# Altium schematic sheet Sheet2.SchDoc
size A2
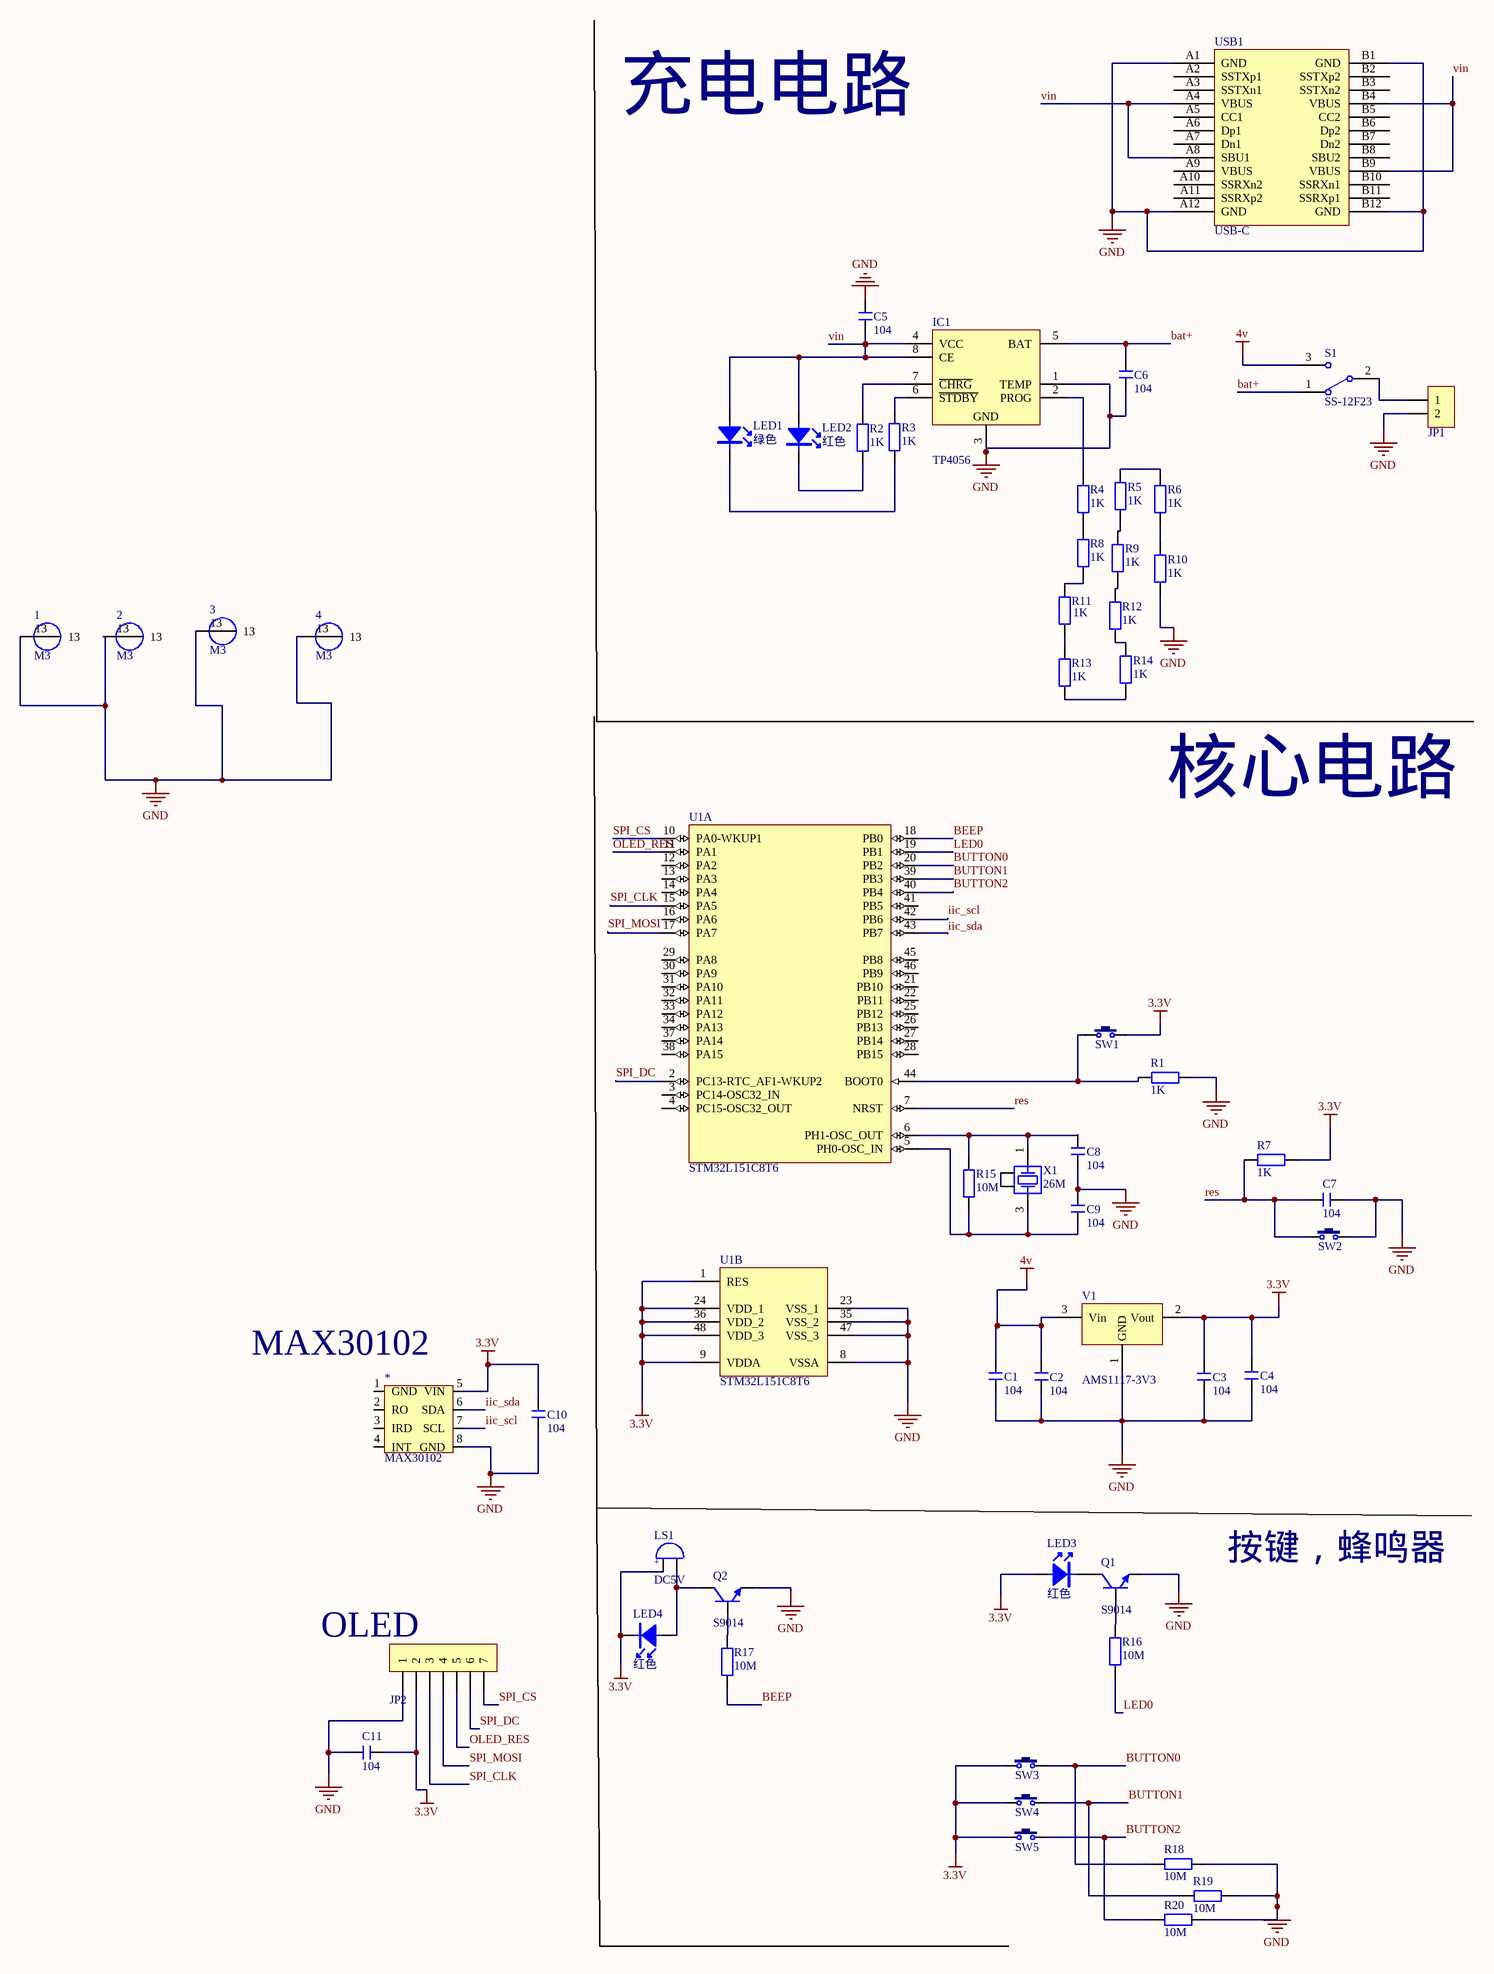
[diagram p0: Sheet2.SchDoc]

## Parts
1  M3  [M3 125X200]
2  M3  [M3 125X200]
3  M3  [M3 125X200]
4  M3  [M3 125X200]
*  MAX30102  [MAX30102]
C1  104  [C 0805_L]
C2  104  [C 0805_L]
C3  104  [C 0805_L]
C4  104  [C 0805_L]
C5  104  [C 0805_L]
C6  104  [C 0805_L]
C7  104  [C 0805_L]
C8  104  [C 0805_L]
C9  104  [C 0805_L]
C10  104  [C 0805_L]
C11  104  [C 0805_L]
IC1  TP4056  [SOP8_N]
JP1  HDR-1X2  [HDR2.54-LI-2P]  (value not drawn)
JP2  HDR-1X7  [HDR2.54-LI-7P]  (value not drawn)
LED1  绿色  [LED 0805G]
LED2  红色  [LED 0805G]
LED3  红色  [LED 0805G]
LED4  红色  [LED 0805G]
LS1  DC5V  [BEEP 5x9x5.5]
Q1  S9014  [SOT23-3N]
Q2  S9014  [SOT23-3N]
R1  1K  [R 0805_L]
R2  1K  [R 0805_L]
R3  1K  [R 0805_L]
R4  1K  [R 0805_L]
R5  1K  [R 0805_L]
R6  1K  [R 0805_L]
R7  1K  [R 0805_L]
R8  1K  [R 0805_L]
R9  1K  [R 0805_L]
R10  1K  [R 0805_L]
R11  1K  [R 0805_L]
R12  1K  [R 0805_L]
R13  1K  [R 0805_L]
R14  1K  [R 0805_L]
R15  10M  [R 0805_L]
R16  10M  [R 0805_L]
R17  10M  [R 0805_L]
R18  10M  [R 0805_L]
R19  10M  [R 0805_L]
R20  10M  [R 0805_L]
S1  SS-12F23  [SS-12F23]
SW1  3x6x5  [TSW SMD-3*6*2.5]  (value not drawn)
SW2  3x6x5  [TSW SMD-3*6*2.5]  (value not drawn)
SW3  3x6x5  [TSW SMD-3*6*2.5]  (value not drawn)
SW4  3x6x5  [TSW SMD-3*6*2.5]  (value not drawn)
SW5  3x6x5  [TSW SMD-3*6*2.5]  (value not drawn)
U1  STM32L151C8T6  [LQFP48_N]  (parts A,B of 2)
USB1  USB-C  [USB-C/S_A]
V1  AMS1117-3V3  [SOT223_L]
X1  26M  [OSC 1612-4P]

## Nets
3.3V: *.5(VIN) C3.1 C4.1 C10.1 C11.1 JP2.2 LED3.1(A) LED4.2(K) LS1.1 R7.1 SW1.2 SW3.1 SW4.1 SW5.1 U1.1(RES) U1.9(VDDA) U1.24(VDD_1) U1.36(VDD_2) U1.48(VDD_3) V1.2(Vout)
4v: C1.1 C2.1 S1.3 V1.3(Vin)
GND: 1.13 2.13 3.13 4.13 *.8(GND) C1.2 C2.2 C3.2 C4.2 C5.2 C6.1 C7.2 C8.2 C9.1 C10.2 C11.2 IC1.1(TEMP) IC1.3(GND) JP1.2 JP2.1 Q1.2(E) Q2.2(E) R1.1 R10.2 R18.2 R19.2 R20.2 SW2.2 U1.8(VSSA) U1.23(VSS_1) U1.35(VSS_2) U1.47(VSS_3) USB1.A1(GND) USB1.A12(GND) USB1.B1(GND) USB1.B12(GND) V1.1(GND)
bat+: C6.2 IC1.5(BAT) S1.1
BEEP: R17.2 U1.18(PB0)
BUTTON0: R18.1 SW3.2 U1.20(PB2)
BUTTON1: R19.1 SW4.2 U1.39(PB3)
BUTTON2: R20.1 SW5.2 U1.40(PB4)
iic_scl: *.7(SCL) U1.42(PB6)
iic_sda: *.6(SDA) U1.43(PB7)
LED0: R16.2 U1.19(PB1)
OLED_RES: JP2.5 U1.11(PA1)
res: C7.1 R7.2 SW2.1 U1.7(NRST)
SPI_CLK: JP2.3 U1.15(PA5)
SPI_CS: JP2.7 U1.10(PA0-WKUP1)
SPI_DC: JP2.6 U1.2(PC13-RTC_AF1-WKUP2)
SPI_MOSI: JP2.4 U1.17(PA7)
vin: C5.1 IC1.4(VCC) IC1.8(CE) LED1.1(A) LED2.1(A) USB1.A4(VBUS) USB1.A8(SBU1) USB1.B4(VBUS) USB1.B9(VBUS)
NetC8_1: C8.1 R15.1 U1.6(PH1-OSC_OUT) X1.1
NetC9_2: C9.2 R15.2 U1.5(PH0-OSC_IN) X1.3
NetIC1_2: IC1.2(PROG) R4.1
NetIC1_6: IC1.6(~{STDBY}) R3.1
NetIC1_7: IC1.7(~{CHRG}) R2.1
NetJP1_1: JP1.1 S1.2
NetLED1_2: LED1.2(K) R3.2
NetLED2_2: LED2.2(K) R2.2
NetLED3_2: LED3.2(K) Q1.3(C)
NetLED4_1: LED4.1(A) LS1.2 Q2.3(C)
NetQ1_1: Q1.1(B) R16.1
NetQ2_1: Q2.1(B) R17.1
NetR1_2: R1.2 SW1.1 U1.44(BOOT0)
NetR4_2: R4.2 R8.1
NetR5_1: R5.1 R6.1
NetR5_2: R5.2 R9.1
NetR6_2: R6.2 R10.1
NetR8_2: R8.2 R11.1
NetR9_2: R9.2 R12.1
NetR11_2: R11.2 R13.1
NetR12_2: R12.2 R14.1
NetR13_2: R13.2 R14.2
NetX1_2: X1.2 X1.4

Not connected (* = marked no-connect by the designer): * 1(GND) 2(RO) 3(IRD) 4(INT); U1 3(PC14-OSC32_IN) 4(PC15-OSC32_OUT) 12(PA2) 13(PA3) 14(PA4) 16(PA6) 21(PB10) 22(PB11) 25(PB12) 26(PB13) 27(PB14) 28(PB15) 29(PA8) 30(PA9) 31(PA10) 32(PA11) 33(PA12) 34(PA13) 37(PA14) 38(PA15) 41(PB5) 45(PB8) 46(PB9); USB1 A2(SSTXp1) A3(SSTXn1) A5(CC1) A6(Dp1) A7(Dn1) A9(VBUS) A10(SSRXn2) A11(SSRXp2) B2(SSTXp2) B3(SSTXn2) B5(CC2) B6(Dp2) B7(Dn2) B8(SBU2) B10(SSRXn1) B11(SSRXp1)

## Notes on the sheet
- 充电电路
- 核心电路
- (near *) MAX30102
- 按键，蜂鸣器
- (near JP2) OLED
- (in symbol BEEP) +

## Library data of the parts
1-4 = M3: 铜柱孔; pin to pad: 13>1; 淘宝ID: 小糖豆的小窝窝; BOM名称: 铜柱孔; 下单链接: https://item.taobao.com/item.htm?ft=t&id=613637044352
C1-C11 = C: 贴片电容; 淘宝ID: 小糖豆的小窝窝; BOM名称: 贴片电容; 下单链接: https://item.taobao.com/item.htm?ft=t&id=613637044352
IC1 = TP4056: 锂电池充电管理; 淘宝ID: 小糖豆的小窝窝; BOM名称: 锂电池充电管理; 下单链接: https://item.taobao.com/item.htm?ft=t&id=613637044352
JP1 = Header 2: 2P接插件; 淘宝ID: 小糖豆的小窝窝; BOM名称: 2P接插件; 下单链接: https://item.taobao.com/item.htm?ft=t&id=613637044352
JP2 = Header 7: 7P接插件; 淘宝ID: 小糖豆的小窝窝; BOM名称: 7P接插件; 下单链接: https://item.taobao.com/item.htm?ft=t&id=613637044352
LED1-LED4 = LED-SMD: 贴片LED; 淘宝ID: 小糖豆的小窝窝; BOM名称: 贴片LED; 下单链接: https://item.taobao.com/item.htm?ft=t&id=613637044352
LS1 = BEEP: 有源蜂鸣器; 淘宝ID: 小糖豆的小窝窝; BOM名称: 有源蜂鸣器; 下单链接: https://item.taobao.com/item.htm?ft=t&id=613637044352
Q1 Q2 = 9014-SMD: 低噪放大-NPN型; 淘宝ID: 小糖豆的小窝窝; BOM名称: 低噪放大-NPN型; 下单链接: https://item.taobao.com/item.htm?ft=t&id=613637044352
R1-R20 = R: 贴片电阻; 淘宝ID: 小糖豆的小窝窝; BOM名称: 贴片电阻; 下单链接: https://item.taobao.com/item.htm?ft=t&id=613637044352
S1 = SSW-1P: 1路波动开关; 淘宝ID: 小糖豆的小窝窝; BOM名称: 1路波动开关; 下单链接: https://item.taobao.com/item.htm?ft=t&id=613637044352
SW1-SW5 = TSW 3x6: 3x6轻触开关; 淘宝ID: 小糖豆的小窝窝; BOM名称: 3x6轻触开关; 下单链接: https://item.taobao.com/item.htm?ft=t&id=613637044352
U1 = STM32L151C8T6: STM32L ARM-based EnergyLite 32-bit MCU, 64 kB Flash, 10 kB Internal RAM, -40 to +85癈 Temperature, 48-pin LQFP, Tray; 淘宝ID: 小糖豆的小窝窝; 下单链接: https://item.taobao.com/item.htm?ft=t&id=613637044352
USB1 = USB-C/S: USB-C型母接口; 淘宝ID: 小糖豆的小窝窝; BOM名称: USB-C型母接口; 下单链接: https://item.taobao.com/item.htm?ft=t&id=613637044352
V1 = AMS1117: 三端稳压芯片; 淘宝ID: 小糖豆的小窝窝; BOM名称: 三端稳压芯片; 下单链接: https://item.taobao.com/item.htm?ft=t&id=613637044352
X1 = XTAL-4P: 4脚无源晶振; 淘宝ID: 小糖豆的小窝窝; BOM名称: 4脚无源晶振; 下单链接: https://item.taobao.com/item.htm?ft=t&id=613637044352